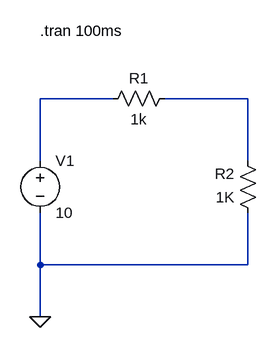
[diagram p0: schematic 1.2.asc]
1.2.asc, the LTspice schematic file:
Version 4
SHEET 1 880 680
WIRE 432 160 320 160
WIRE 640 160 512 160
WIRE 320 256 320 160
WIRE 640 256 640 160
WIRE 320 416 320 336
WIRE 640 416 640 336
WIRE 640 416 320 416
WIRE 320 496 320 416
FLAG 320 496 0
SYMBOL Res 528 144 R90
WINDOW 0 0 56 VBottom 2
WINDOW 3 32 56 VTop 2
SYMATTR InstName R1
SYMATTR Value 1k
SYMBOL Res 656 352 R180
WINDOW 0 36 76 Left 2
WINDOW 3 36 40 Left 2
SYMATTR InstName R2
SYMATTR Value 1K
SYMBOL Voltage 320 240 R0
SYMATTR InstName V1
SYMATTR Value 10
TEXT 320 56 Left 2 !.tran 100ms

The netlist it stands for:
* 1.2.asc
R1 N002 N001 1k
R2 0 N002 1K
V1 N001 0 10
.tran 100ms
.backanno
.end